# Altium schematic sheet TOP.SchDoc: TOP
size A3; CompanyName: STMicroelectronics; Organization: Microcontrollers Division; DocumentNumber: 3; SheetNumber: 2; SheetTotal: 19
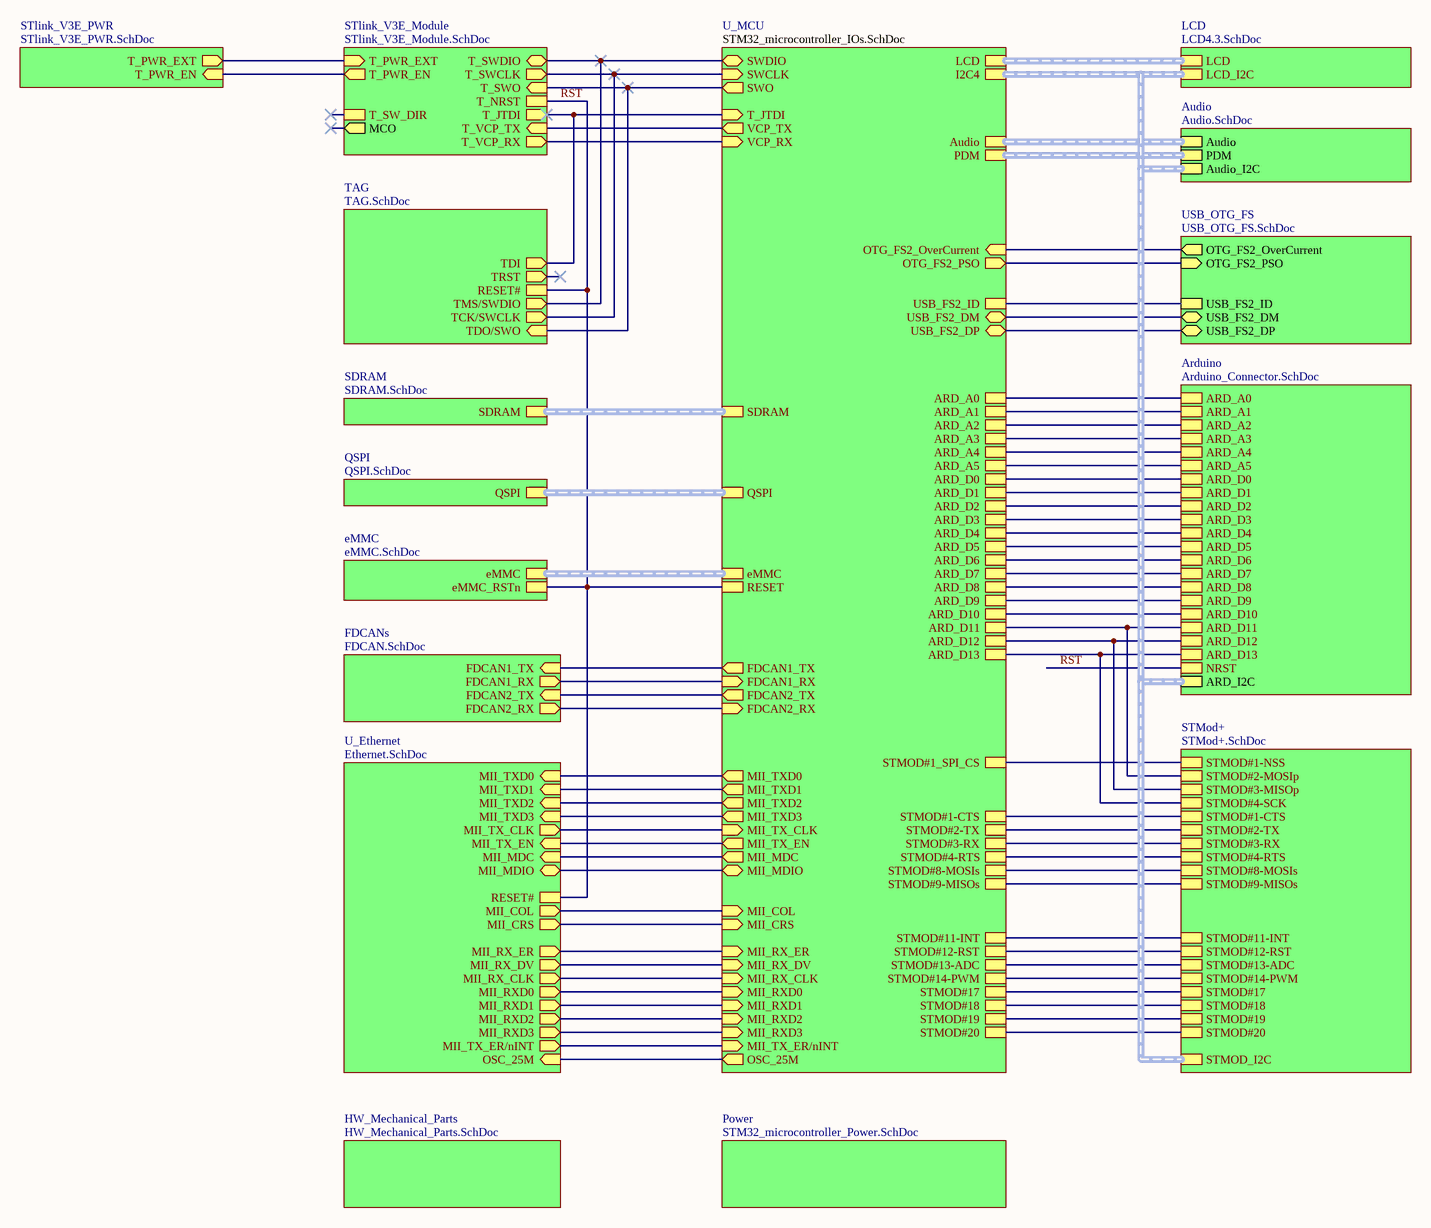
[diagram p0: TOP.SchDoc]

## Sub-sheets
Arduino = Arduino_Connector.SchDoc: NRST, ARD_A0, ARD_A1, ARD_A2, ARD_A3, ARD_A4, ARD_A5, ARD_D5, ARD_D4, ARD_D3, ARD_D2, ARD_D1, ARD_D0, ARD_D13, ARD_D12, ARD_D11, ARD_D10, ARD_D9, ARD_D8, ARD_D6, ARD_D7, ARD_I2C (harness I2C)
Audio = Audio.SchDoc: Audio (harness SAI), Audio_I2C (harness I2C), PDM (harness PDM)
eMMC = eMMC.SchDoc: eMMC (harness eMMC), eMMC_RSTn
FDCANs = FDCAN.SchDoc: FDCAN1_TX (in), FDCAN1_RX (out), FDCAN2_TX (in), FDCAN2_RX (out)
HW_Mechanical_Parts = HW_Mechanical_Parts.SchDoc: no entries
LCD = LCD4.3.SchDoc: LCD (harness LCD), LCD_I2C (harness I2C)
Power = STM32_microcontroller_Power.SchDoc: no entries
QSPI = QSPI.SchDoc: QSPI (harness QSPI)
SDRAM = SDRAM.SchDoc: SDRAM (harness SDRAM)
STlink_V3E_Module = STlink_V3E_Module.SchDoc: T_SW_DIR, T_SWCLK (out), T_SWO (in), T_NRST, MCO (out), T_SWDIO (bidir), T_PWR_EXT (in), T_PWR_EN (out), T_VCP_TX (in), T_VCP_RX (out), T_JTDI (out)
STlink_V3E_PWR = STlink_V3E_PWR.SchDoc: T_PWR_EXT (out), T_PWR_EN (in)
STMod+ = STMod+.SchDoc: STMOD#12-RST, STMOD#1-NSS, STMOD#11-INT, STMOD#3-MISOp, STMOD#2-TX, STMOD#2-MOSIp, STMOD#3-RX, STMOD#4-SCK, STMOD#8-MOSIs, STMOD#13-ADC, STMOD#14-PWM, STMOD#19, STMOD#20, STMOD#1-CTS, STMOD#17, STMOD#18, STMOD#4-RTS, STMOD_I2C (harness I2C), STMOD#9-MISOs
TAG = TAG.SchDoc: TDI (out), RESET#, TRST (out), TMS/SWDIO (out), TCK/SWCLK (out), TDO/SWO (in)
U_Ethernet = Ethernet.SchDoc: MII_TXD0 (in), MII_TX_EN (in), MII_TX_CLK (out), MII_RXD0 (out), MII_RX_ER (out), MII_RX_DV (out), MII_RX_CLK (out), MII_COL (out), MII_CRS (out), RESET#, MII_TXD1 (in), MII_TXD2 (in), MII_TXD3 (in), MII_RXD1 (out), MII_RXD2 (out), MII_RXD3 (out), MII_TX_ER/nINT (out), MII_MDC (in), MII_MDIO (bidir), OSC_25M (in)
U_MCU = STM32_microcontroller_IOs.SchDoc: LCD (harness LCD), eMMC (harness eMMC), Audio (harness SAI), PDM (harness PDM), MII_TXD0 (out), MII_TX_EN (out), MII_TX_CLK (in), MII_RXD0 (in), MII_RX_ER (in), MII_RX_DV (in), MII_RX_CLK (in), MII_COL (in), MII_CRS (in), MII_TXD1 (out), MII_TXD2 (out), MII_TXD3 (out), MII_RXD1 (in), MII_RXD2 (in), MII_RXD3 (in), MII_TX_ER/nINT (in), MII_MDC (out), MII_MDIO (bidir), SWDIO (bidir), SWCLK (in), SWO (out), VCP_RX (in), VCP_TX (out), I2C4 (harness I2C), ARD_D5, ARD_D4, ARD_D3, ARD_D2, ARD_D1, ARD_D0, ARD_D13, ARD_D12, ARD_D11, ARD_D10, ARD_D9, ARD_D8, ARD_D6, ARD_D7, ARD_A0, ARD_A1, ARD_A2, ARD_A3, ARD_A4, ARD_A5, RESET, OTG_FS2_PSO (out), OTG_FS2_OverCurrent (in), USB_FS2_DM (bidir), USB_FS2_DP (bidir), USB_FS2_ID, FDCAN1_TX (out), FDCAN1_RX (in), FDCAN2_TX (out), FDCAN2_RX (in), STMOD#1_SPI_CS, STMOD#11-INT, STMOD#12-RST, STMOD#2-TX, STMOD#3-RX, STMOD#8-MOSIs, STMOD#9-MISOs, STMOD#13-ADC, STMOD#14-PWM, STMOD#17, STMOD#18, STMOD#1-CTS, STMOD#4-RTS, STMOD#19, STMOD#20, SDRAM (harness SDRAM), OSC_25M (out), T_JTDI (in), QSPI (harness QSPI)
USB_OTG_FS = USB_OTG_FS.SchDoc: OTG_FS2_OverCurrent (out), USB_FS2_DM (bidir), USB_FS2_DP (bidir), USB_FS2_ID, OTG_FS2_PSO (in)

## Nets
RST: sheet TAG/RESET#, sheet Arduino/NRST, sheet U_MCU/RESET, sheet eMMC/eMMC_RSTn, sheet U_Ethernet/RESET#, sheet STlink_V3E_Module/T_NRST
(unnamed): sheet TAG/TDI, sheet U_MCU/T_JTDI, sheet STlink_V3E_Module/T_JTDI
(unnamed): sheet TAG/TMS/SWDIO, sheet U_MCU/SWDIO, sheet STlink_V3E_Module/T_SWDIO
(unnamed): sheet TAG/TCK/SWCLK, sheet U_MCU/SWCLK, sheet STlink_V3E_Module/T_SWCLK
(unnamed): sheet TAG/TDO/SWO, sheet U_MCU/SWO, sheet STlink_V3E_Module/T_SWO
(unnamed): sheet USB_OTG_FS/OTG_FS2_OverCurrent, sheet U_MCU/OTG_FS2_OverCurrent
(unnamed): sheet USB_OTG_FS/USB_FS2_DM, sheet U_MCU/USB_FS2_DM
(unnamed): sheet USB_OTG_FS/USB_FS2_DP, sheet U_MCU/USB_FS2_DP
(unnamed): sheet USB_OTG_FS/USB_FS2_ID, sheet U_MCU/USB_FS2_ID
(unnamed): sheet USB_OTG_FS/OTG_FS2_PSO, sheet U_MCU/OTG_FS2_PSO
(unnamed): sheet Arduino/ARD_A0, sheet U_MCU/ARD_A0
(unnamed): sheet Arduino/ARD_A1, sheet U_MCU/ARD_A1
(unnamed): sheet Arduino/ARD_A2, sheet U_MCU/ARD_A2
(unnamed): sheet Arduino/ARD_A3, sheet U_MCU/ARD_A3
(unnamed): sheet Arduino/ARD_A4, sheet U_MCU/ARD_A4
(unnamed): sheet Arduino/ARD_A5, sheet U_MCU/ARD_A5
(unnamed): sheet Arduino/ARD_D5, sheet U_MCU/ARD_D5
(unnamed): sheet Arduino/ARD_D4, sheet U_MCU/ARD_D4
(unnamed): sheet Arduino/ARD_D3, sheet U_MCU/ARD_D3
(unnamed): sheet Arduino/ARD_D2, sheet U_MCU/ARD_D2
(unnamed): sheet Arduino/ARD_D1, sheet U_MCU/ARD_D1
(unnamed): sheet Arduino/ARD_D0, sheet U_MCU/ARD_D0
(unnamed): sheet Arduino/ARD_D13, sheet STMod+/STMOD#4-SCK, sheet U_MCU/ARD_D13
(unnamed): sheet Arduino/ARD_D12, sheet STMod+/STMOD#3-MISOp, sheet U_MCU/ARD_D12
(unnamed): sheet Arduino/ARD_D11, sheet STMod+/STMOD#2-MOSIp, sheet U_MCU/ARD_D11
(unnamed): sheet Arduino/ARD_D10, sheet U_MCU/ARD_D10
(unnamed): sheet Arduino/ARD_D9, sheet U_MCU/ARD_D9
(unnamed): sheet Arduino/ARD_D8, sheet U_MCU/ARD_D8
(unnamed): sheet Arduino/ARD_D6, sheet U_MCU/ARD_D6
(unnamed): sheet Arduino/ARD_D7, sheet U_MCU/ARD_D7
(unnamed): sheet STMod+/STMOD#12-RST, sheet U_MCU/STMOD#12-RST
(unnamed): sheet STMod+/STMOD#1-NSS, sheet U_MCU/STMOD#1_SPI_CS
(unnamed): sheet STMod+/STMOD#11-INT, sheet U_MCU/STMOD#11-INT
(unnamed): sheet STMod+/STMOD#2-TX, sheet U_MCU/STMOD#2-TX
(unnamed): sheet STMod+/STMOD#3-RX, sheet U_MCU/STMOD#3-RX
(unnamed): sheet STMod+/STMOD#8-MOSIs, sheet U_MCU/STMOD#8-MOSIs
(unnamed): sheet STMod+/STMOD#13-ADC, sheet U_MCU/STMOD#13-ADC
(unnamed): sheet STMod+/STMOD#14-PWM, sheet U_MCU/STMOD#14-PWM
(unnamed): sheet STMod+/STMOD#19, sheet U_MCU/STMOD#19
(unnamed): sheet STMod+/STMOD#20, sheet U_MCU/STMOD#20
(unnamed): sheet STMod+/STMOD#1-CTS, sheet U_MCU/STMOD#1-CTS
(unnamed): sheet STMod+/STMOD#17, sheet U_MCU/STMOD#17
(unnamed): sheet STMod+/STMOD#18, sheet U_MCU/STMOD#18
(unnamed): sheet STMod+/STMOD#4-RTS, sheet U_MCU/STMOD#4-RTS
(unnamed): sheet STMod+/STMOD#9-MISOs, sheet U_MCU/STMOD#9-MISOs
(unnamed): sheet U_MCU/MII_TXD0, sheet U_Ethernet/MII_TXD0
(unnamed): sheet U_MCU/MII_TX_EN, sheet U_Ethernet/MII_TX_EN
(unnamed): sheet U_MCU/MII_TX_CLK, sheet U_Ethernet/MII_TX_CLK
(unnamed): sheet U_MCU/MII_RXD0, sheet U_Ethernet/MII_RXD0
(unnamed): sheet U_MCU/MII_RX_ER, sheet U_Ethernet/MII_RX_ER
(unnamed): sheet U_MCU/MII_RX_DV, sheet U_Ethernet/MII_RX_DV
(unnamed): sheet U_MCU/MII_RX_CLK, sheet U_Ethernet/MII_RX_CLK
(unnamed): sheet U_MCU/MII_COL, sheet U_Ethernet/MII_COL
(unnamed): sheet U_MCU/MII_CRS, sheet U_Ethernet/MII_CRS
(unnamed): sheet U_MCU/MII_TXD1, sheet U_Ethernet/MII_TXD1
(unnamed): sheet U_MCU/MII_TXD2, sheet U_Ethernet/MII_TXD2
(unnamed): sheet U_MCU/MII_TXD3, sheet U_Ethernet/MII_TXD3
(unnamed): sheet U_MCU/MII_RXD1, sheet U_Ethernet/MII_RXD1
(unnamed): sheet U_MCU/MII_RXD2, sheet U_Ethernet/MII_RXD2
(unnamed): sheet U_MCU/MII_RXD3, sheet U_Ethernet/MII_RXD3
(unnamed): sheet U_MCU/MII_TX_ER/nINT, sheet U_Ethernet/MII_TX_ER/nINT
(unnamed): sheet U_MCU/MII_MDC, sheet U_Ethernet/MII_MDC
(unnamed): sheet U_MCU/MII_MDIO, sheet U_Ethernet/MII_MDIO
(unnamed): sheet U_MCU/VCP_RX, sheet STlink_V3E_Module/T_VCP_RX
(unnamed): sheet U_MCU/VCP_TX, sheet STlink_V3E_Module/T_VCP_TX
(unnamed): sheet U_MCU/FDCAN1_TX, sheet FDCANs/FDCAN1_TX
(unnamed): sheet U_MCU/FDCAN1_RX, sheet FDCANs/FDCAN1_RX
(unnamed): sheet U_MCU/FDCAN2_TX, sheet FDCANs/FDCAN2_TX
(unnamed): sheet U_MCU/FDCAN2_RX, sheet FDCANs/FDCAN2_RX
(unnamed): sheet U_MCU/OSC_25M, sheet U_Ethernet/OSC_25M
(unnamed): sheet STlink_V3E_Module/T_PWR_EXT, sheet STlink_V3E_PWR/T_PWR_EXT
(unnamed): sheet STlink_V3E_Module/T_PWR_EN, sheet STlink_V3E_PWR/T_PWR_EN

## Buses and harness runs
harness sheet Arduino/ARD_I2C = sheet Audio/Audio_I2C = sheet LCD/LCD_I2C = sheet STMod+/STMOD_I2C = sheet U_MCU/I2C4
harness sheet Audio/Audio = sheet U_MCU/Audio
harness sheet Audio/PDM = sheet U_MCU/PDM
harness sheet eMMC/eMMC = sheet U_MCU/eMMC
harness sheet LCD/LCD = sheet U_MCU/LCD
harness sheet QSPI/QSPI = sheet U_MCU/QSPI
harness sheet SDRAM/SDRAM = sheet U_MCU/SDRAM

## Notes on the sheet
- Title:
- Project:
- Size:
- Revision:
- Variant:
- A3
- -
- Date:
- Reference:
- Sheet:
- of